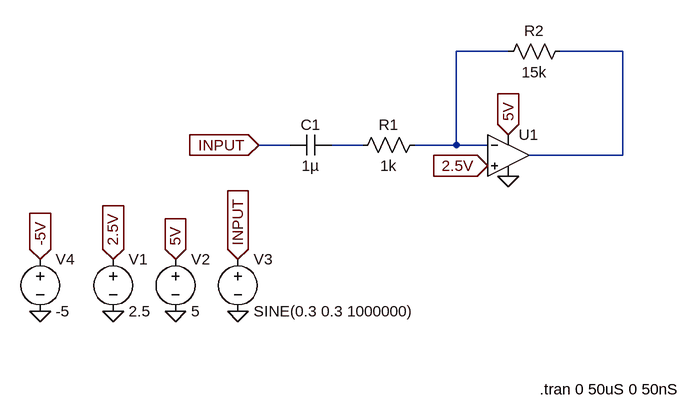
[diagram p0: schematic TransducerAmp.asc]
TransducerAmp.asc, the LTspice schematic file:
Version 4
SHEET 1 880 680
WIRE 384 16 304 16
WIRE 560 16 464 16
WIRE 48 160 0 160
WIRE 160 160 112 160
WIRE 304 160 304 16
WIRE 304 160 240 160
WIRE 352 160 304 160
WIRE 560 176 560 16
WIRE 560 176 416 176
FLAG -224 336 2.5V
IOPIN -224 336 In
FLAG -224 416 0
FLAG -128 416 0
FLAG -32 416 0
FLAG -128 336 5V
IOPIN -128 336 In
FLAG -32 336 INPUT
IOPIN -32 336 In
FLAG 0 160 INPUT
IOPIN 0 160 In
FLAG -336 416 0
FLAG -336 336 -5V
IOPIN -336 336 In
FLAG 352 192 2.5V
IOPIN 352 192 In
FLAG 384 144 5V
IOPIN 384 144 In
FLAG 384 208 0
SYMBOL voltage -224 320 R0
WINDOW 123 0 0 Left 0
WINDOW 39 0 0 Left 0
SYMATTR InstName V1
SYMATTR Value 2.5
SYMBOL voltage -128 320 R0
WINDOW 123 0 0 Left 0
WINDOW 39 0 0 Left 0
SYMATTR InstName V2
SYMATTR Value 5
SYMBOL voltage -32 320 R0
WINDOW 123 0 0 Left 0
WINDOW 39 0 0 Left 0
SYMATTR InstName V3
SYMATTR Value SINE(0.3 0.3 1000000)
SYMBOL res 256 144 R90
WINDOW 0 0 56 VBottom 2
WINDOW 3 32 56 VTop 2
SYMATTR InstName R1
SYMATTR Value 1k
SYMBOL res 480 0 R90
WINDOW 0 0 56 VBottom 2
WINDOW 3 32 56 VTop 2
SYMATTR InstName R2
SYMATTR Value 15k
SYMBOL voltage -336 320 R0
WINDOW 123 0 0 Left 0
WINDOW 39 0 0 Left 0
SYMATTR InstName V4
SYMATTR Value -5
SYMBOL cap 112 144 R90
WINDOW 0 0 32 VBottom 2
WINDOW 3 32 32 VTop 2
SYMATTR InstName C1
SYMATTR Value 1µ
SYMBOL OpAmps\\UniversalOpamp2 384 176 R0
SYMATTR InstName U1
TEXT 432 536 Left 2 !.tran 0 50uS 0 50nS

The netlist it stands for:
* TransducerAmp.asc
V1 2.5V 0 2.5
V2 5V 0 5
V3 INPUT 0 SINE(0.3 0.3 1000000)
R1 N001 N003 1k
R2 N002 N001 15k
V4 -5V 0 -5
C1 N003 INPUT 1µ
XU1 2.5V N001 5V 0 N002 level.2 Avol=1Meg GBW=10Meg Slew=10Meg ilimit=25m rail=0 Vos=0 phimargin=45 en=0 enk=0 in=0 ink=0 Rin=500Meg  ; pins IN+ IN- V+ V- OUT
.tran 0 50uS 0 50nS
.lib UniversalOpamps2.sub
.backanno
.end